# EAGLE design drawbars_v12_2019 (EAGLE 6.4)
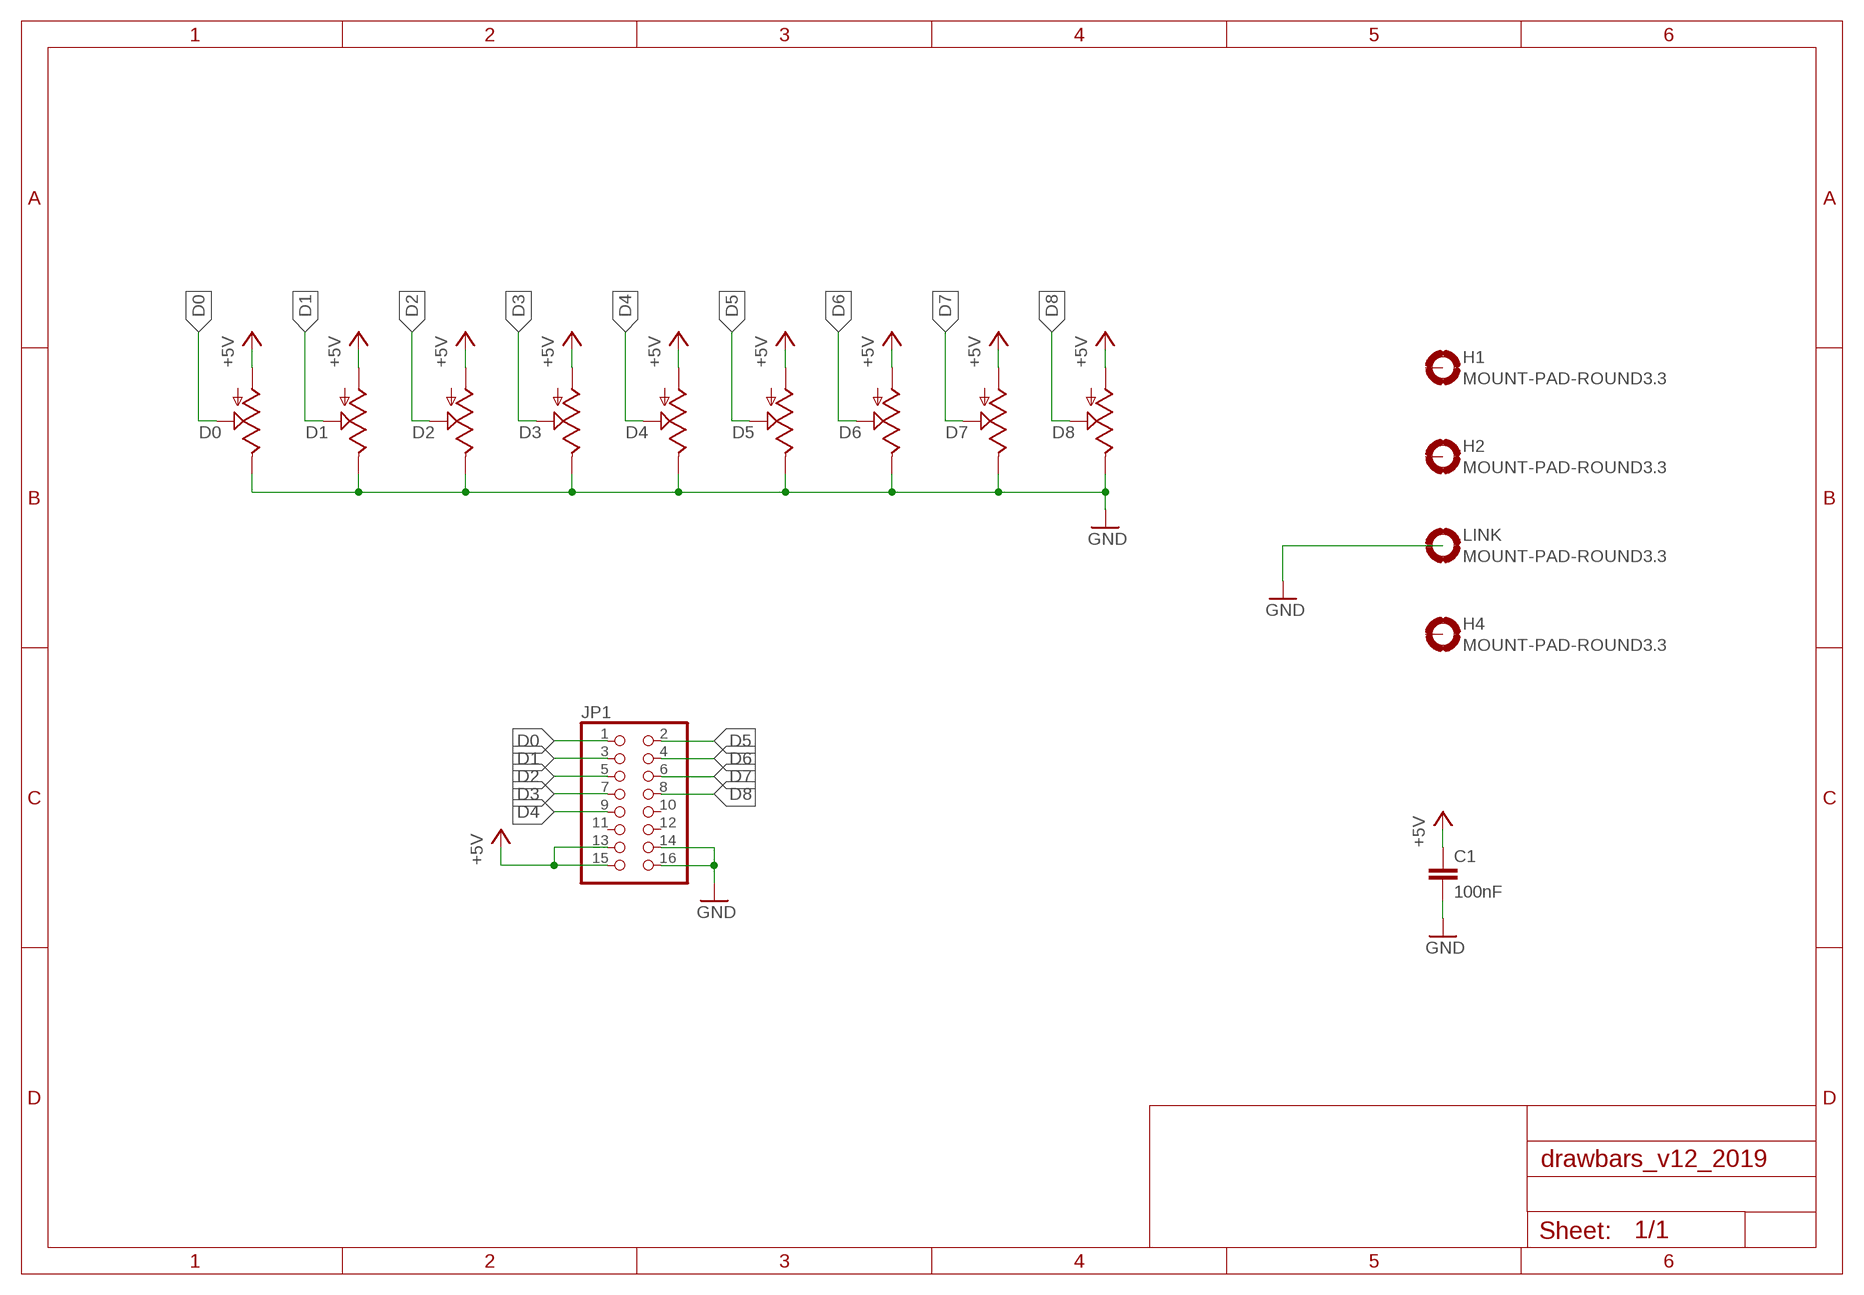
[diagram p0: schematic, sheet 1]

## Parts
C1  100nF  C-EU050-024X044  [C050-024X044]
D0  POTENTIOMETER  [ALPHA_DRAWBARS]
D1  POTENTIOMETER  [ALPHA_DRAWBARS]
D2  POTENTIOMETER  [ALPHA_DRAWBARS]
D3  POTENTIOMETER  [ALPHA_DRAWBARS]
D4  POTENTIOMETER  [ALPHA_DRAWBARS]
D5  POTENTIOMETER  [ALPHA_DRAWBARS]
D6  POTENTIOMETER  [ALPHA_DRAWBARS]
D7  POTENTIOMETER  [ALPHA_DRAWBARS]
D8  POTENTIOMETER  [ALPHA_DRAWBARS]
H1  MOUNT-PAD-ROUND3.3  [3,3-PAD]
H2  MOUNT-PAD-ROUND3.3  [3,3-PAD]
H4  MOUNT-PAD-ROUND3.3  [3,3-PAD]
JP1  PINHD-2X8  [2X08]
LINK  MOUNT-PAD-ROUND3.3  [3,3-PAD]

## Nets
+5V [+5v]: C1.1 D0.P$2 D1.P$2 D2.P$2 D3.P$2 D4.P$2 D5.P$2 D6.P$2 D7.P$2 D8.P$2 JP1.13 JP1.15
D0: D0.P$3 JP1.1
D1: D1.P$3 JP1.3
D2: D2.P$3 JP1.5
D3: D3.P$3 JP1.7
D4: D4.P$3 JP1.9
D5: D5.P$3 JP1.2
D6: D6.P$3 JP1.4
D7: D7.P$3 JP1.6
D8: D8.P$3 JP1.8
GND [GND]: C1.2 D0.P$1 D1.P$1 D2.P$1 D3.P$1 D4.P$1 D5.P$1 D6.P$1 D7.P$1 D8.P$1 JP1.14 JP1.16
Unconnected: H1.B3,3(MOUNT) H2.B3,3(MOUNT) H4.B3,3(MOUNT) JP1.10 JP1.11 JP1.12 LINK.B3,3(MOUNT)

## Library data of the parts
C1 = rcl:C-EU: CAPACITOR, European symbol
D0 D1-D8 = Potentiometers:POTENTIOMETER: Potentiometer
H1 H2 H4 LINK = holes:MOUNT-PAD-ROUND: MOUNTING PAD, round
JP1 = pinhead:PINHD-2X8: PIN HEADER

## Net classes
0 default: width 0.305 mm, drill 0.152 mm, clearance 0.254 mm
1 +5v: width 0.508 mm, drill 0.152 mm, clearance 0.406 mm
2 GND: width 1.016 mm, drill 0.152 mm, clearance 1.016 mm

## Board
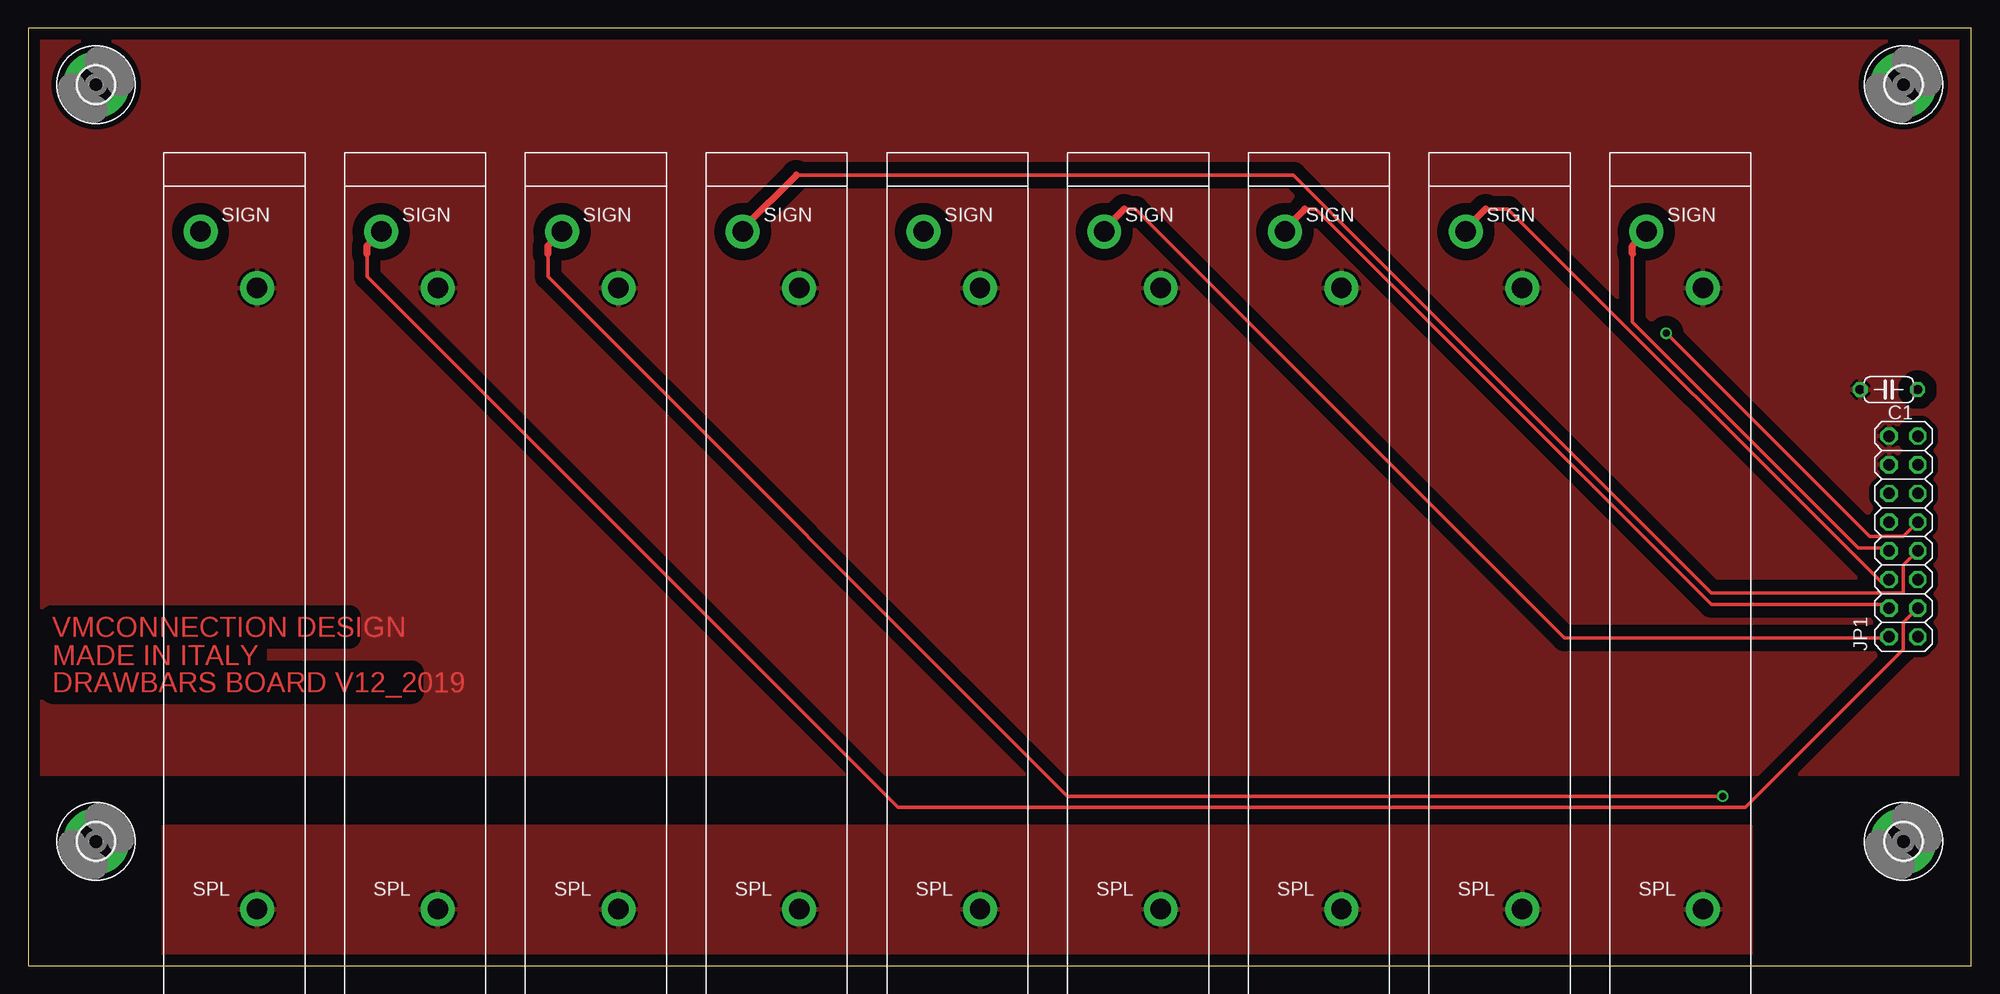
[diagram p1: board, top side]
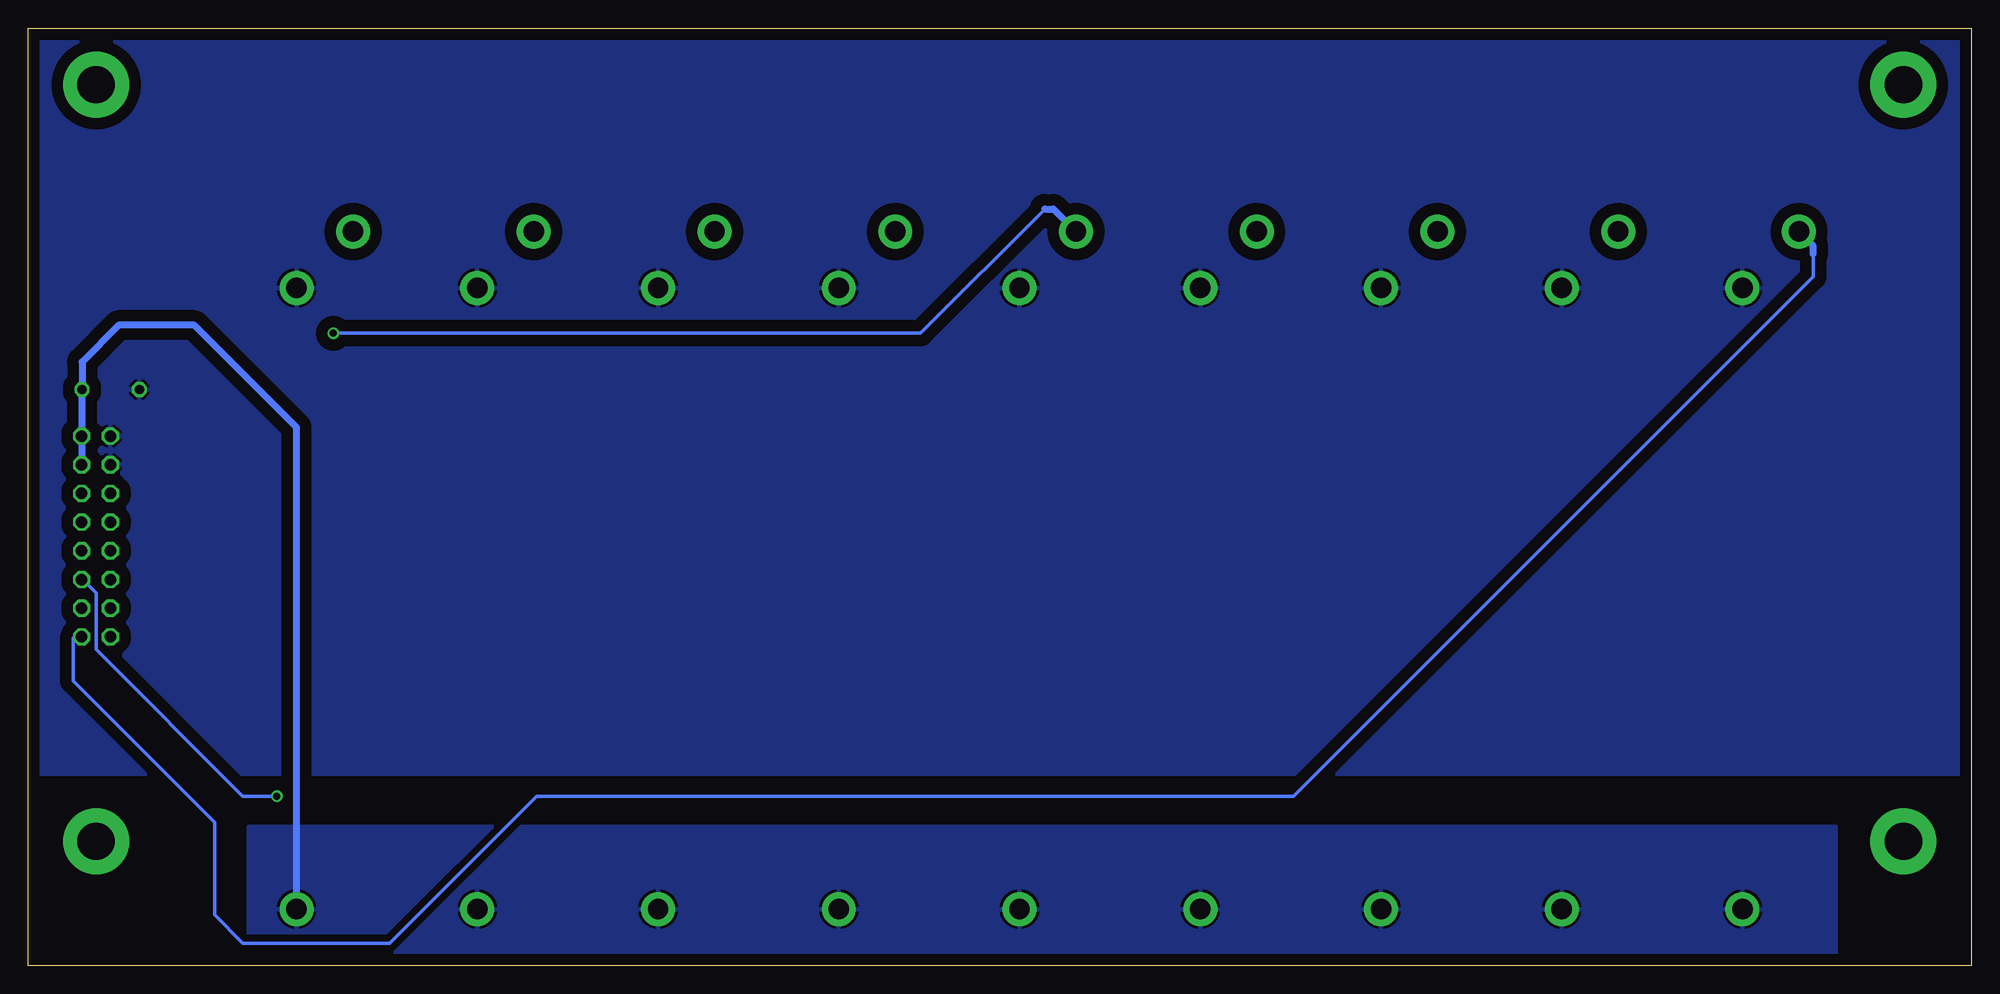
[diagram p2: board, bottom side, seen from below]

Size 172 x 83 mm. Coordinates in mm from the lower left corner, seen from the top.
Outline: 0,0 172,0 172,83 0,83 0,0
Copper layers (1*16): Top 0.035mm / dielectric 1.5mm / Bottom 0.035mm
Design rules "default": minimum track width 10mil, minimum drill 24mil, track to track 8mil, track to pad 8mil, pad to pad 8mil, via to via 8mil, smd to smd 8mil, copper to edge 40mil, drill to drill 8mil, minimum pad ring 10mil, minimum via ring 8mil, stop-mask expansion 4mil, vias tented up to drill 0mil, thermal gap 10mil

### Footprints (pad centres in the part's own frame; a part is rotated, then mirrored left to right if it is on the bottom)
C050-024X044 = drill 0.813 octagon: 1 -2.54,0; 2 2.54,0
ALPHA_DRAWBARS = drill 1.8 pad 3: P$1 8.25,64; P$2 8.25,9; P$3 3.25,69
3,3-PAD = drill 3.3 pad 5.842: B3,3 0,0
2X08 = drill 1.016 octagon: 1 -8.89,-1.27; 2 -8.89,1.27; 3 -6.35,-1.27; 4 -6.35,1.27; 5 -3.81,-1.27; 6 -3.81,1.27; 7 -1.27,-1.27; 8 -1.27,1.27; 9 1.27,-1.27; 10 1.27,1.27; 11 3.81,-1.27; 12 3.81,1.27; 13 6.35,-1.27; 14 6.35,1.27; 15 8.89,-1.27; 16 8.89,1.27

### Placement (x,y rotation side)
C1  164.7,51 180 top
D0  12,-4 0 top
D1  28,-4 0 top
D2  44,-4 0 top
D3  60,-4 0 top
D4  76,-4 0 top
D5  92,-4 0 top
D6  108,-4 0 top
D7  124,-4 0 top
D8  140,-4 0 top
H1  6,11 0 top
H2  6,78 0 top
H4  166,78 0 top
JP1  166,38 90 top
LINK  166,11 0 top

### Tracks (layer width: path | path; a pad name or v marks a point on that pad's centre or on a via)
+5V
  Bottom 0.61: D8.P$2 148.25,47.65 157.3,56.7 164,56.7 167.24,53.46 C1.1 167.27,50.97 JP1.15 JP1.13
  pour Bottom (isolate 0.61): 12,0 152.5,0 152.5,12.3 12,12.3
  pour Top (isolate 0.61): 12,0 152.5,0 152.5,12.3 12,12.3
D0
  Bottom 0.305: 14,63 14,61 60,15 127,15 140,2 153,2 155.5,4.5 155.5,12.7 168,25.2 168,29 JP1.1
  Bottom 0.61: 14,63 14,63.75 D0.P$3
D1
  Top 0.305: 30,63 30,61 77,14 152,14 166,28 166,30.38 JP1.3
  Top 0.61: 30,63 30,63.75 D1.P$3
D2  (via drill 0.61)
  Top 0.305: v150,15 92,15 46,61 46,63
  Top 0.61: 46,63 46,63.75 D2.P$3
  Bottom 0.305: v150,15 153,15 166,28 166,33 167,34 JP1.5
D3
  Top 0.305: 68,70 112,70 149,33 166,33 166,35.46 JP1.7
  Top 0.61: 68,70 63.25,65.25 D3.P$3
D4  (via drill 0.61)
  Top 0.305: JP1.9 166,38 163,38 v145,56
  Bottom 0.305: v145,56 93,56 82,67
  Bottom 0.61: 82,67 81.25,67 D4.P$3
D5
  Top 0.305: 97,67 98,67 136,29 164,29 JP1.2
  Top 0.61: 97,67 95.25,65.25 D5.P$3
D6
  Top 0.305: 113,67 114,67 149,32 165,32 JP1.4
  Top 0.61: 113,67 111.25,65.25 D6.P$3
D7
  Top 0.305: 129,67 131,67 164,34 JP1.6
  Top 0.61: 129,67 127.25,65.25 D7.P$3
D8
  Top 0.305: 142,63 142,57 162,37 164,37 JP1.8
  Top 0.61: 142,63 142,63.75 D8.P$3
GND
  pour Bottom (isolate 0.61): 0,83 172,83 172,17 0,17
  pour Top (isolate 0.61): 0,83 172,83 172,17 0,17

### Text on the board
Top: VMCONNECTION DESIGN | MADE IN ITALY | DRAWBARS BOARD V12_2019